# EAGLE design nanino mini (EAGLE 7.3.0)
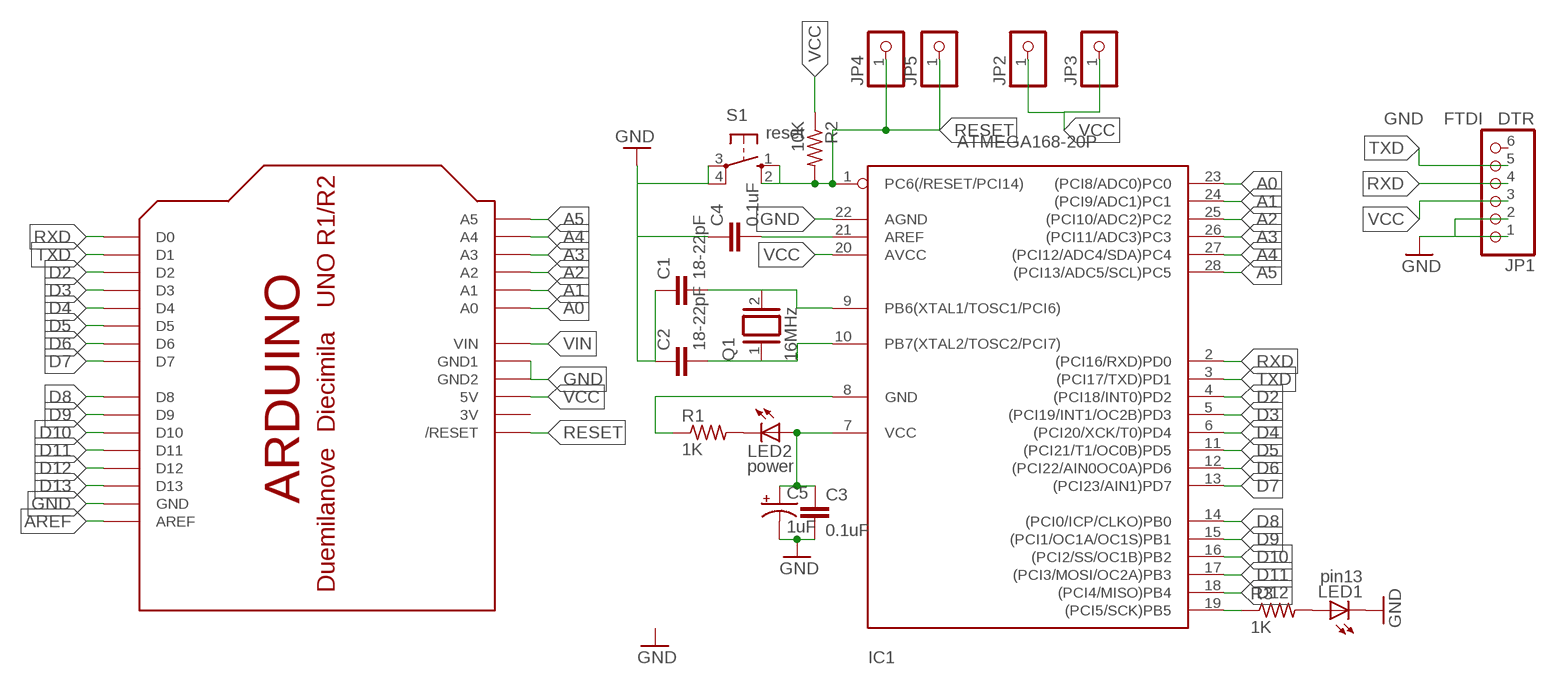
[diagram p0: schematic, sheet 1]

## Parts
C1  18-22pF  C-EU025-030X050  [C025-030X050]
C2  18-22pF  C-EU025-030X050  [C025-030X050]
C3  0.1uF  C-EU025-030X050  [C025-030X050]
C4  0.1uF  C-EU025-030X050  [C025-030X050]
C5  1uF  CPOL-USE2.5-6  [E2,5-6]
IC1  ATMEGA168-20P  [DIL28-3]
JP1  GND FTDI DTR  PINHD-1X6  [1X06]
JP2  PINHD-1X1CB  [1X01-CLEANBIG]
JP3  PINHD-1X1CB  [1X01-CLEANBIG]
JP4  PINHD-1X1CB  [1X01-CLEANBIG]
JP5  PINHD-1X1CB  [1X01-CLEANBIG]
LED1  pin13  LED3MM  [LED3MM]
LED2  power  LED3MM  [LED3MM]
Q1  16MHz  XTAL/S  [QS]
R1  1K  R-US_0207/10  [0207/10]
R2  10K  R-US_0207/10  [0207/10]
R3  1K  R-US_0207/10  [0207/10]
S1  reset  10-XX  [B3F-10XX]
U$1  ARDUINOUNO  [ARDUINO]

## Nets
A0: IC1.23((PCI8/ADC0)PC0) U$1.A0
A1: IC1.24((PCI9/ADC1)PC1) U$1.A1
A2: IC1.25((PCI10/ADC2)PC2) U$1.A2
A3: IC1.26((PCI11/ADC3)PC3) U$1.A3
A4: IC1.27((PCI12/ADC4/SDA)PC4) U$1.A4
A5: IC1.28((PCI13/ADC5/SCL)PC5) U$1.A5
AREF: C4.2 IC1.21(AREF) U$1.AREF
D2: IC1.4((PCI18/INT0)PD2) U$1.D2
D3: IC1.5((PCI19/INT1/OC2B)PD3) U$1.D3
D4: IC1.6((PCI20/XCK/T0)PD4) U$1.D4
D5: IC1.11((PCI21/T1/OC0B)PD5) U$1.D5
D6: IC1.12((PCI22/AIN0OC0A)PD6) U$1.D6
D7: IC1.13((PCI23/AIN1)PD7) U$1.D7
D8: IC1.14((PCI0/ICP/CLKO)PB0) U$1.D8
D9: IC1.15((PCI1/OC1A/OC1S)PB1) U$1.D9
D10: IC1.16((PCI2/SS/OC1B)PB2) U$1.D10
D11: IC1.17((PCI3/MOSI/OC2A)PB3) U$1.D11
D12: IC1.18((PCI4/MISO)PB4) U$1.D12
D13: IC1.19((PCI5/SCK)PB5) R3.1 U$1.D13
GND: C1.1 C2.1 C3.2 C4.1 C5.- IC1.8(GND) IC1.22(AGND) JP1.1 JP1.2 LED1.K(C) R1.1 S1.3(P) S1.4(P1) U$1.GND U$1.GND1 U$1.GND2
N$1: C1.2 IC1.9(PB6(XTAL1/TOSC1/PCI6)) Q1.2
N$2: C2.2 IC1.10(PB7(XTAL2/TOSC2/PCI7)) Q1.1
N$3: LED2.K(C) R1.2
N$4: LED1.A R3.2
RESET: IC1.1(PC6(/RESET/PCI14)) JP4.1 JP5.1 R2.2 S1.1(S) U$1.RESET(/RESET)
RXD: IC1.2((PCI16/RXD)PD0) JP1.4 U$1.D0
TXD: IC1.3((PCI17/TXD)PD1) JP1.5 U$1.D1
VCC: C3.1 C5.+ IC1.7(VCC) IC1.20(AVCC) JP1.3 JP2.1 JP3.1 LED2.A R2.1 U$1.5V
VIN: U$1.VIN
Unconnected: JP1.6 S1.2(S1)

## Power pins joined to a net without a drawn wire
3V: U$1.3V

## Library data of the parts
C1-C4 = rcl:C-EU: CAPACITOR, European symbol
C5 = adafruit:CPOL-US: POLARIZED CAPACITOR, American symbol
IC1 = adafruit:ATMEGA168*P: MICROCONTROLLER 16 kBytes FLASH 1 kBytes SRAM 512 Bytes EEPROM USART 8-channel 10 bit ADC
JP1 = adafruit:PINHD-1X6: PIN HEADER
JP2-JP5 = adafruit:PINHD-1X1: Pin header 1x1 for 0.1" spacing With round pins
LED1 LED2 = adafruit:LED: LED OSRAM: - CHIPLED LG R971, LG N971, LY N971, LG Q971, LY Q971, LO R971, LY R971 LH N974, LH R974 LS Q976, LO Q976, LY Q976 LO Q996 - Hyper CHIPLED LW Q18S LB Q993, LB Q99A, LB R99A - SideLED LS A670, LO A670, LY A670, LG A670, LP A670 LB A673, LV A673, LT A673, LW A673 LH A674 LY A675 LS A676, LA A676, LO A676, LY A676, LW A676 LS A679, LY A679, LG A679 - Hyper Micro SIDELED® LS Y876, LA Y876, LO Y876, LY Y876 LT Y87S - SmartLED LW L88C, LW L88S LB L89C, LB L89S, LG L890 LS L89K, LO L89K, LY L89K LS L896, LA L896, LO L896, LY L896 - TOPLED LS T670, LO T670, LY T670, LG T670, LP T670 LSG T670, LSP T670, LSY T670, LOP T670, LYG T670 LG T671, LOG T671, LSG T671 LB T673, LV T673, LT T673, LW T673 LH T674 LS T676, LA T676, LO T676, LY T676, LB T676, LH T676, LSB T676, LW T676 LB T67C, LV T67C, LT T67C, LS T67K, LO T67K, LY T67K, LW E67C LS E67B, LA E67B, LO E67B, LY E67B, LB E67C, LV E67C, LT E67C LW T67C LS T679, LY T679, LG T679 LS T770, LO T770, LY T770, LG T770, LP T770 LB T773, LV T773, LT T773, LW T773 LH T774 LS E675, LA E675, LY E675, LS T675 LS T776, LA T776, LO T776, LY T776, LB T776 LHGB T686 LT T68C, LB T68C - Hyper Mini TOPLED® LB M676 - Mini TOPLED Santana® LG M470 LS M47K, LO M47K, LY M47K Source: http://www.osram.convergy.de/
Q1 = special:XTAL/S: CRYSTAL
R1-R3 = adafruit:R-US_: RESISTOR, American symbol
S1 = switch-omron:10-XX: OMRON SWITCH; MPN: B3F-1000; OC_FARNELL: 176432; OC_NEWARK: 36M3542
U$1 = adafruit:ARDUINO: Arduino Diecimila/Duemilanove Make a shield with ease, this package has all the named pins as well as the two mounting drill holes and an outline of the USB and DC power connector. The outline is on the DIMENSION layer, so if your board house uses it they will cut the outline to match. http://www.ladyada.net/library/pcb/eaglelibrary.html

## Net classes
0 default: width 0.813 mm

## Board
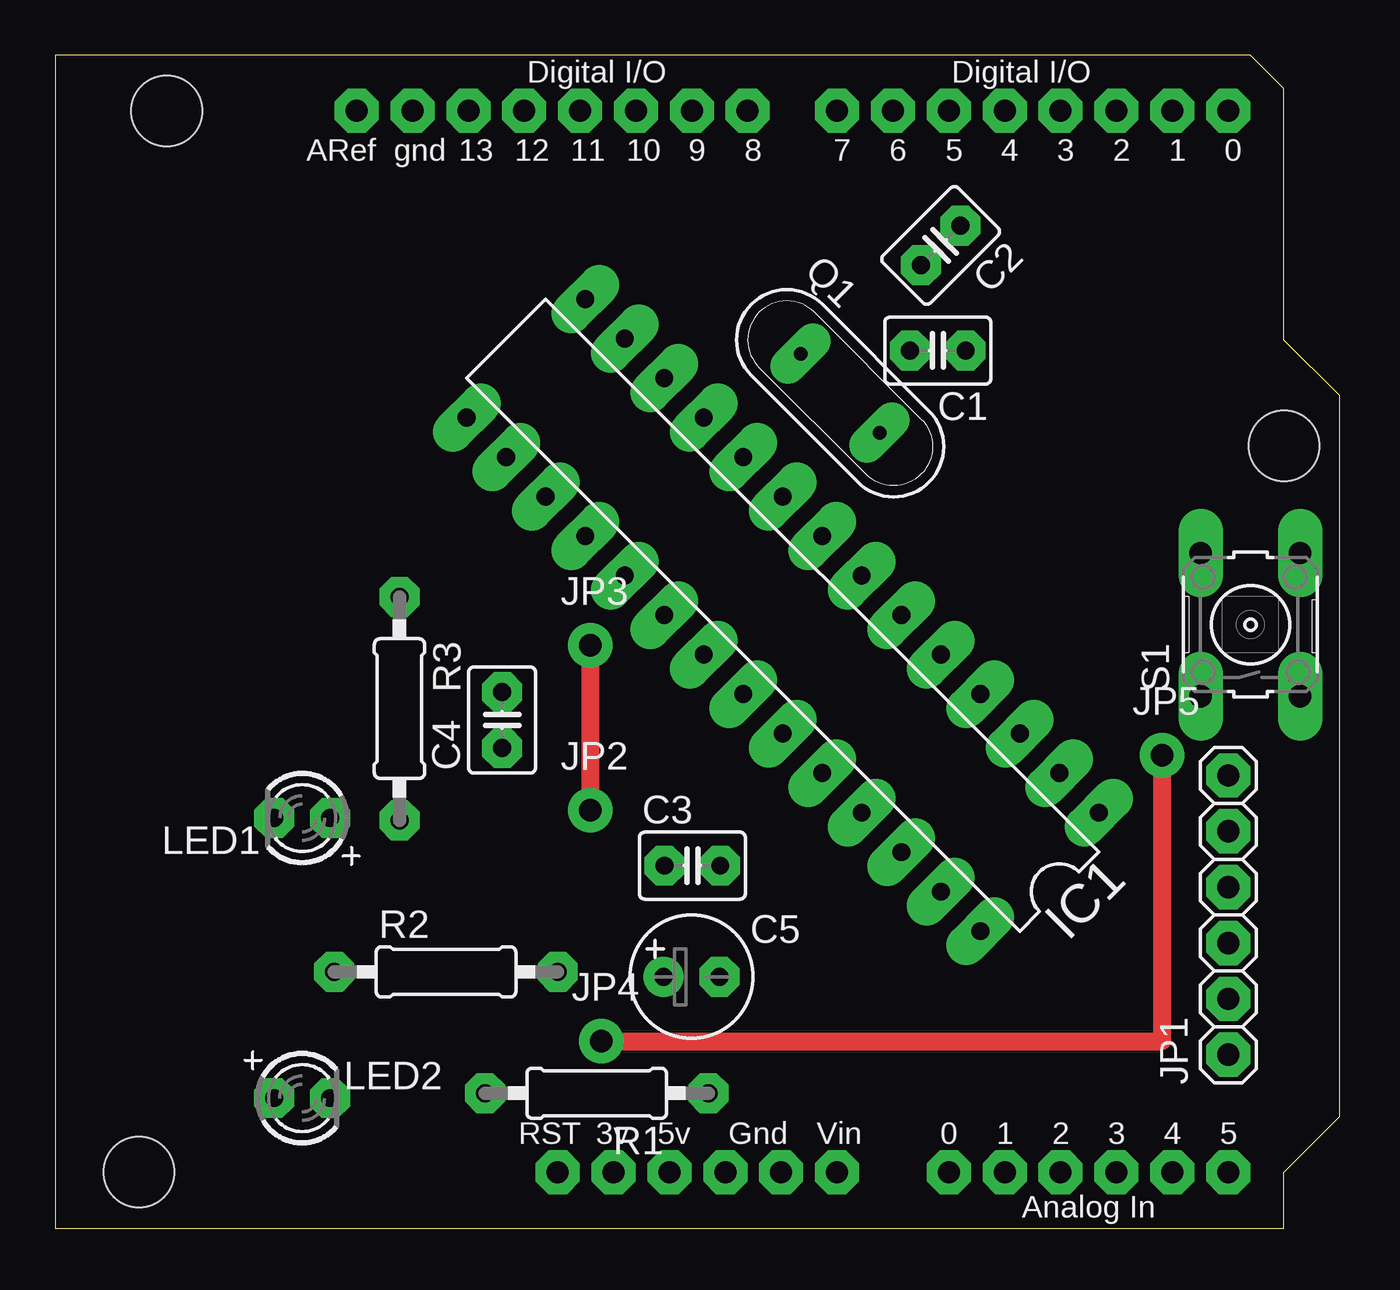
[diagram p1: board, top side]
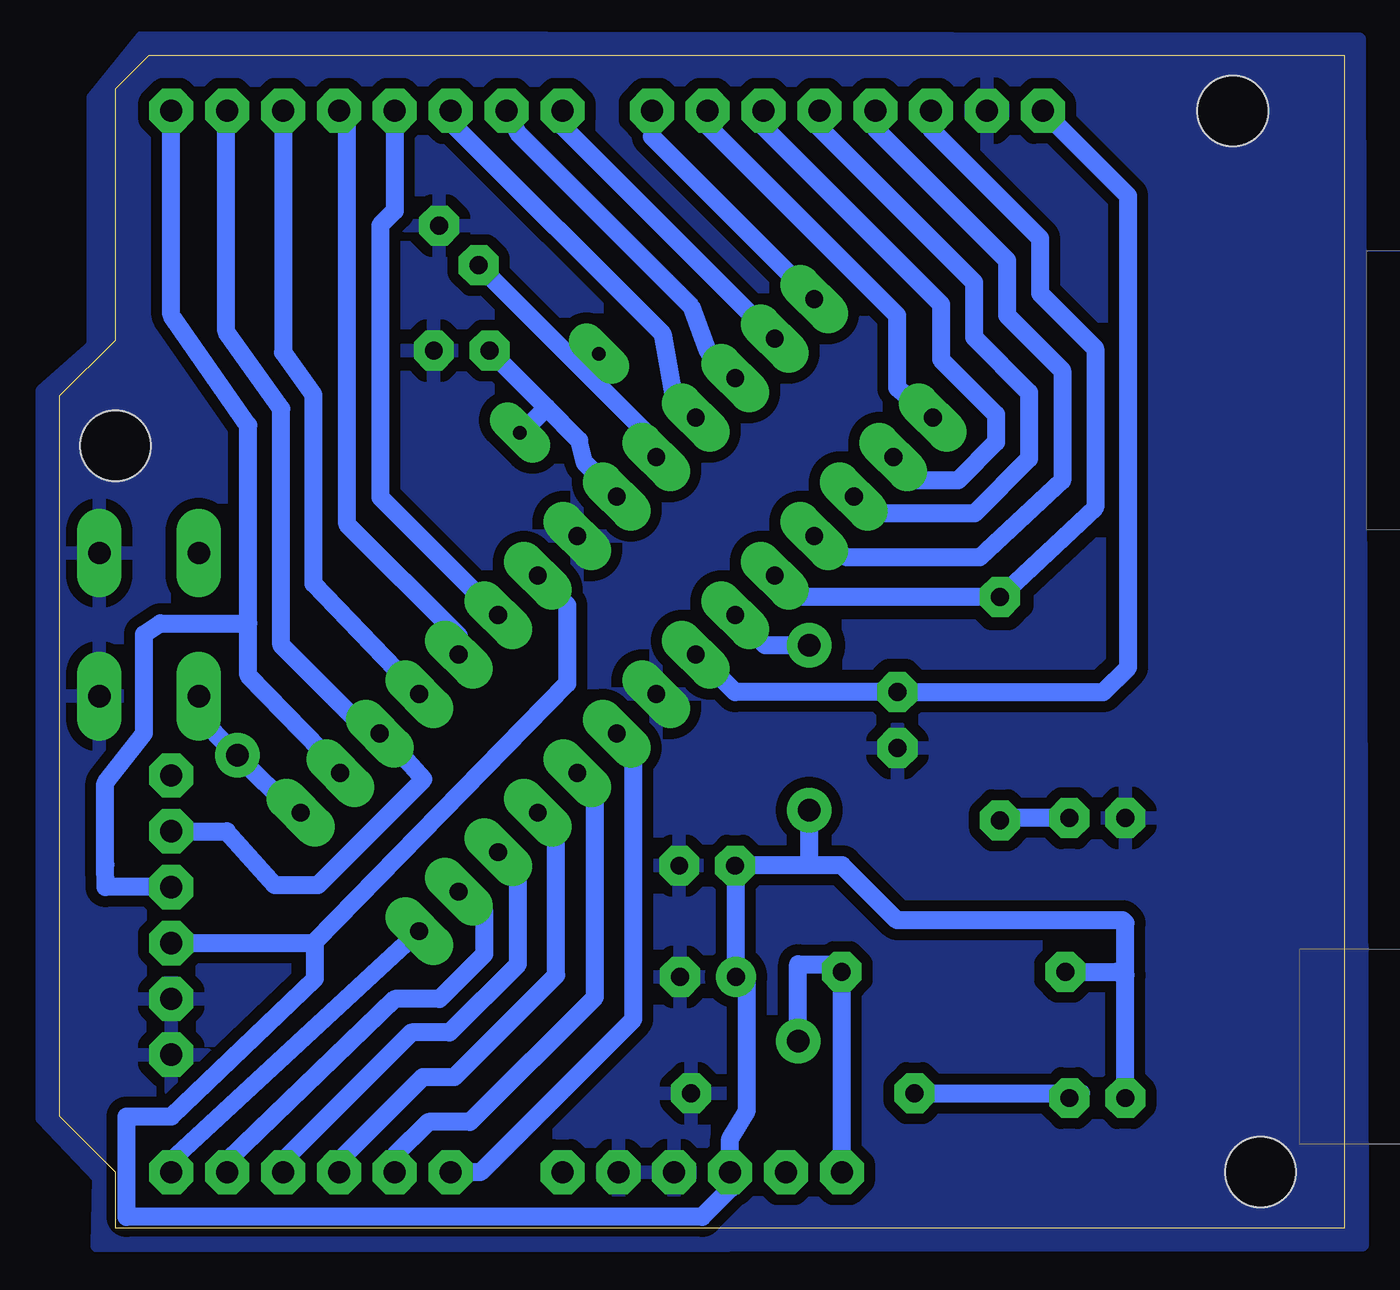
[diagram p2: board, bottom side, seen from below]

Size 58.42 x 53.34 mm. Coordinates in mm from the lower left corner, seen from the top.
Copper layers (1*16): Top 0.035mm / dielectric 1.5mm / Bottom 0.035mm
Design rules "FablabImperia DRC v2  *": minimum track width 0.33mm, minimum drill 0.8mm, track to track 0.5mm, track to pad 0.6mm, pad to pad 0.2mm, via to via 0.2mm, smd to smd 0.2mm, copper to edge 0mil, drill to drill 8mil, minimum pad ring 0.5mm, minimum via ring 0.5mm, stop-mask expansion 0mil, vias tented up to drill 0mil, thermal gap 20mil

### Footprints (pad centres in the part's own frame; a part is rotated, then mirrored left to right if it is on the bottom)
C025-030X050 = drill 0.813 octagon: 1 -1.27,0; 2 1.27,0
E2,5-6 = drill 0.813 pad 1.778: + -1.27,0 | drill 0.813 pad 1.778 octagon: - 1.27,0
DIL28-3 = drill 0.813 long: 1 -16.51,-3.81; 2 -13.97,-3.81; 3 -11.43,-3.81; 4 -8.89,-3.81; 5 -6.35,-3.81; 6 -3.81,-3.81; 7 -1.27,-3.81; 8 1.27,-3.81; 9 3.81,-3.81; 10 6.35,-3.81; 11 8.89,-3.81; 12 11.43,-3.81; 13 13.97,-3.81; 14 16.51,-3.81; 15 16.51,3.81; 16 13.97,3.81; 17 11.43,3.81; 18 8.89,3.81; 19 6.35,3.81; 20 3.81,3.81; 21 1.27,3.81; 22 -1.27,3.81; 23 -3.81,3.81; 24 -6.35,3.81; 25 -8.89,3.81; 26 -11.43,3.81; 27 -13.97,3.81; 28 -16.51,3.81
1X06 = drill 1.016 octagon: 1 -6.35,0; 2 -3.81,0; 3 -1.27,0; 4 1.27,0; 5 3.81,0; 6 6.35,0
1X01-CLEANBIG = drill 1.016 pad 1.778: 1 0,0
LED3MM = drill 0.813 pad 1.676 octagon: A -1.27,0; K 1.27,0
QS = drill 0.61 long: 1 -2.54,0; 2 2.54,0
0207/10 = drill 0.813 pad 1.676 octagon: 1 -5.08,0; 2 5.08,0
B3F-10XX = drill 1.016 long: 1 -3.251,2.261; 2 3.251,2.261; 3 -3.251,-2.261; 4 3.251,-2.261
ARDUINO = drill 1 pad 1.676 octagon: 3V 35.56,2.54; 5V 38.1,2.54; A0 50.8,2.54; A1 53.34,2.54; A2 55.88,2.54; A3 58.42,2.54; A4 60.96,2.54; A5 63.5,2.54; AREF 23.876,50.8; D0 63.5,50.8; D1 60.96,50.8; D2 58.42,50.8; D3 55.88,50.8; D4 53.34,50.8; D5 50.8,50.8; D6 48.26,50.8; D7 45.72,50.8; D8 41.656,50.8; D9 39.116,50.8; D10 36.576,50.8; D11 34.036,50.8; D12 31.496,50.8; D13 28.956,50.8; GND 26.416,50.8; GND1 43.18,2.54; GND2 40.64,2.54; RESET 33.02,2.54; VIN 45.72,2.54 | hole 3.2: 15.24,50.8; 66.04,35.56; 13.97,2.54

### Placement (x,y rotation side)
C1  40.14,39.9 180 top
C2  40.27,44.68 225 top
C3  28.98,16.48 0 top
C4  20.33,23.1 90 top
C5  28.94,11.43 0 top
IC1  33.09,27.87 135 top
JP1  53.35,14.23 90 top
JP2  24.34,19 0 top
JP3  24.34,26.5 0 top
JP4  24.84,8.5 0 top
JP5  50.34,21.5 0 top
LED1  11.24,18.64 180 top
LED2  11.23,5.91 0 top
Q1  35.7,37.96 315 top
R1  24.63,6.13 180 top
R2  17.78,11.65 0 top
R3  15.66,23.62 270 top
S1  54.36,27.44 90 top
U$1  -10.16,0 0 top

### Tracks (layer width: path | path; a pad name or v marks a point on that pad's centre or on a via)
A0
  Bottom 0.813: IC1.23 32.33,22.23 32.33,9.5 39.29,2.54 U$1.A0
A1
  Bottom 0.813: IC1.24 34.09,20.14 34.09,10.5 39.76,4.83 41.66,4.83 43.18,3.3 U$1.A1
A2
  Bottom 0.813: IC1.25 35.84,18.05 35.84,11.5 40.48,6.86 41.91,6.86 45.72,3.05 U$1.A2
A3
  Bottom 0.813: IC1.26 37.59,16.46 37.59,12 40.7,8.89 42.42,8.89 48.26,3.05 U$1.A3
A4
  Bottom 0.813: U$1.A4 50.8,3.05 43.18,10.41 41.15,10.41 39.12,12.45 39.12,14.39 40.02,15.3 IC1.27
A5
  Bottom 0.813: IC1.28 53.09,3.3 U$1.A5
AREF
  Bottom 0.813: U$1.AREF 9.84,46.92 9.84,25.5 10.97,24.37 C4.2 27.71,24.37 29.41,26.07 IC1.21
D2
  Bottom 0.813: U$1.D2 48.26,39.81 46.89,37.89 46.89,29.3 IC1.4
D3
  Bottom 0.813: IC1.5 40.27,26.93 45.34,32 45.34,50.42 U$1.D3
D4
  Bottom 0.813: U$1.D4 43.18,46.26 43.84,45.6 43.84,33.23 IC1.6
D5
  Bottom 0.813: IC1.11 30.48,37.83 30.99,40.64 40.64,50.29 U$1.D5
D6
  Bottom 0.813: U$1.D6 37.59,49.81 29.72,41.91 28.96,39.88 IC1.12
D7
  Bottom 0.813: U$1.D7 35.56,50.1 IC1.13
D8
  Bottom 0.813: U$1.D8 31.5,49.62 IC1.14
D9
  Bottom 0.813: U$1.D9 28.96,50.12 20.34,41.5 20.34,38.22 IC1.15
D10
  Bottom 0.813: U$1.D10 26.42,50.08 18.34,42 18.34,39.5 15.84,37 15.84,35.74 17.58,34 19.46,34 IC1.16
D11
  Bottom 0.813: U$1.D11 23.88,50.04 16.84,43 16.84,40.5 14.34,38 14.34,34.98 16.82,32.5 21.05,32.5 IC1.17
D12
  Bottom 0.813: U$1.D12 21.34,50 15.34,44 15.34,41.5 12.84,39 12.84,33.98 16.59,30.49 22.63,30.49 IC1.18
D13
  Bottom 0.813: U$1.D13 18.8,49.96 13.84,45 13.84,42.5 11.34,40 11.34,32.77 R3.1 24.89,28.7 IC1.19
GND
  pour Bottom: 54.69,54.12 56.9,51.4 56.9,40.1 59.2,38.05 59.2,5 56.64,2.29 56.7,-0.81 -0.82,-0.75 -0.66,54.06
  pour Bottom (isolate 0.61): 10.16,25.4 10.16,32.51 11.68,32.51 11.68,32.26 16.51,27.94 23.88,27.94 23.88,24.38 11.18,24.38
N$1
  Bottom 0.813: IC1.9 33.09,33.36 34.54,34.8 34.8,35.81 36.28,37.31 | 36.28,37.31 C1.2 | Q1.2 37.5,36.09 36.28,37.31
N$2
  Bottom 0.813: IC1.10 31.29,35.71 34.71,39.13 | 34.71,39.13 C2.2 | Q1.1 34.08,39.76 34.71,39.13
N$3
  Bottom 0.813: R1.2 11.97,6.13 LED2.K
N$4
  Bottom 0.813: LED1.A 15.66,18.64 R3.2
N$6
  pour Bottom: 0.76,32 7.62,32 7.62,0 0.76,0
  pour Bottom: 6.35,3.81 21.08,3.81 21.08,0.51 6.35,0.51
RESET
  Top 0.813: JP4.1 50.34,8.5 JP5.1
  Bottom 0.813: U$1.RESET R2.2 23.21,12 24.84,12 JP4.1 | IC1.1 47.73,18.89 JP5.1 52.35,23.51 S1.1
RXD
  Bottom 0.813: IC1.2 45.66,20.82 49.85,25.14 49.85,27.5 | 49.85,27.5 49.85,36.5 53.34,41.52 U$1.D0 | JP1.4 56.33,15.5 56.34,16.52 56.34,20.23 54.59,22.49 54.59,27.01 53.84,27.5 49.85,27.5
TXD
  Bottom 0.813: JP1.5 50.82,18.04 48.64,15.6 46.68,15.6 41.88,20.4 42.64,21.26 IC1.3 44.32,22.48 48.35,26.51 48.35,37.25 50.84,40.76 50.84,50.76 U$1.D1
VCC
  Top 0.813: JP2.1 JP3.1
  Bottom 0.813: 46.82,13.02 35.34,24.75 35.34,28.32 IC1.7 | LED2.A 9.96,11.5 | 9.96,11.5 9.96,13.87 10.09,14 20.34,14 22.84,16.5 24.34,16.5 | 24.34,16.5 27.69,16.5 C3.1 27.67,16.44 C5.+ 27.18,11.16 27.18,5.33 27.94,4.06 U$1.5V 27.94,1.78 29.21,0.51 55.37,0.51 55.37,5.08 53.34,5.08 46.82,11.34 46.82,13.02 | R2.1 10.37,11.65 9.96,11.5 | JP2.1 24.34,16.5 | JP3.1 26.33,26.5 IC1.20 | JP1.3 46.88,12.96 46.82,13.02

### Text on the board
bRestrict: NANINO 0.8 MINI / (CC-BY-NC-SA) | Rev. 00